# Altium schematic sheet Bluetooth interface - RN42.SchDoc
size A4; Organization: Altium Limited; Address1: 3 Minna Close; Address2: Belrose; Address3: NSW 2085; Address4: Australia
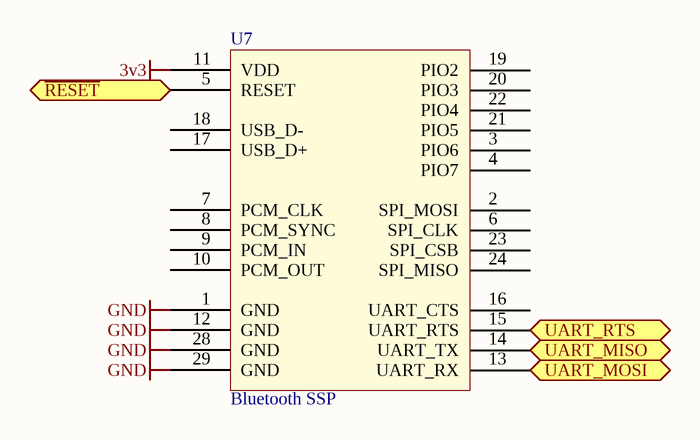
[diagram p0: Bluetooth interface - RN42.SchDoc]

## Parts
U7  Bluetooth SSP  [BlueTooth_RN4x]

## Ports
UART_MISO (out), UART_MOSI (in), UART_RTS (out), ~{RESET}

## Nets
3v3: U7.11(VDD)
GND: U7.1(GND) U7.12(GND) U7.28(GND) U7.29(GND)
~{RESET}: U7.5(RESET) ; port ~{RESET}
UART_MISO: U7.14(UART_TX) ; port UART_MISO
UART_MOSI: U7.13(UART_RX) ; port UART_MOSI
UART_RTS: U7.15(UART_RTS) ; port UART_RTS

Not connected (* = marked no-connect by the designer): U7 2(SPI_MOSI) 3(PIO6) 4(PIO7) 6(SPI_CLK) 7(PCM_CLK) 8(PCM_SYNC) 9(PCM_IN) 10(PCM_OUT) 16(UART_CTS) 17(USB_D+) 18(USB_D-) 19(PIO2) 20(PIO3) 21(PIO5) 22(PIO4) 23(SPI_CSB) 24(SPI_MISO)

## Notes on the sheet
- Title
- Size:
- Date:
- A4
- Name:
- Time:
- Ing. W. Pietersz
- Revision:
- Sheet
- of
- WillyPietersz@gmail.com
- Contact:
- info@unique-system.nl
- Unique System Elektronics
- Biesboschhaven noord 1-b
- 4251 NL Werkendam
- Netherlands
- www.unique-system.nl
- File:

## Library data of the parts
U7 = BlueTooth-RN42: Wireless, Bluetooth; Part Number: BlueTooth-RN42; Component Type: Wireless, Bluetooth; ComponentLink1Description: Datasheet; ComponentLink1URL: http://www.sparkfun.com/datasheets/Wireless/Bluetooth/rn-42-ds.pdf